# Altium project LED_Nixie_Display_Pills.PrjPcb
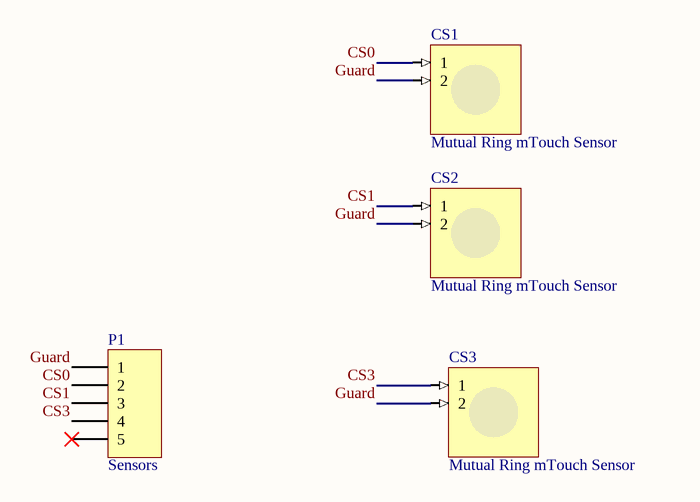
[diagram p0: Touch.SchDoc]
1 sheet, 4 parts. Net scope: global (net labels, ports and power ports of the same name join across sheets).
Board file: TouchBoard.PcbDoc

## Sheet Touch.SchDoc
size A4

### Parts
CS1  Mutual Ring mTouch Sensor  (no BOM)
CS2  Mutual Ring mTouch Sensor  (no BOM)
CS3  Mutual Ring mTouch Sensor  (no BOM)
P1  Sensors  [HDR1X5]

### Nets
CS0: CS1.1 P1.2
CS1: CS2.1 P1.3
CS3: CS3.1 P1.4
Guard: CS1.2 CS2.2 CS3.2 P1.1

Not connected (* = marked no-connect by the designer): P1 5*

### Library data of the parts
CS1-CS3 = mTouchMutualRingSensor: ConfiguratorName: MICROCHIP_TOUCH; ConfigurationParameters: {}__sensorid[MutualCircle]{}inPadRadius[4]{}middlePadWidth[1]{}outPadWidth[1]{}
P1 = Header 5: Header, 5-Pin; LatestRevisionDate: 17-Jul-2002; LatestRevisionNote: Re-released for DXP Platform.; Publisher: Altium Limited